# EAGLE design ULA (EAGLE 9.6.2)
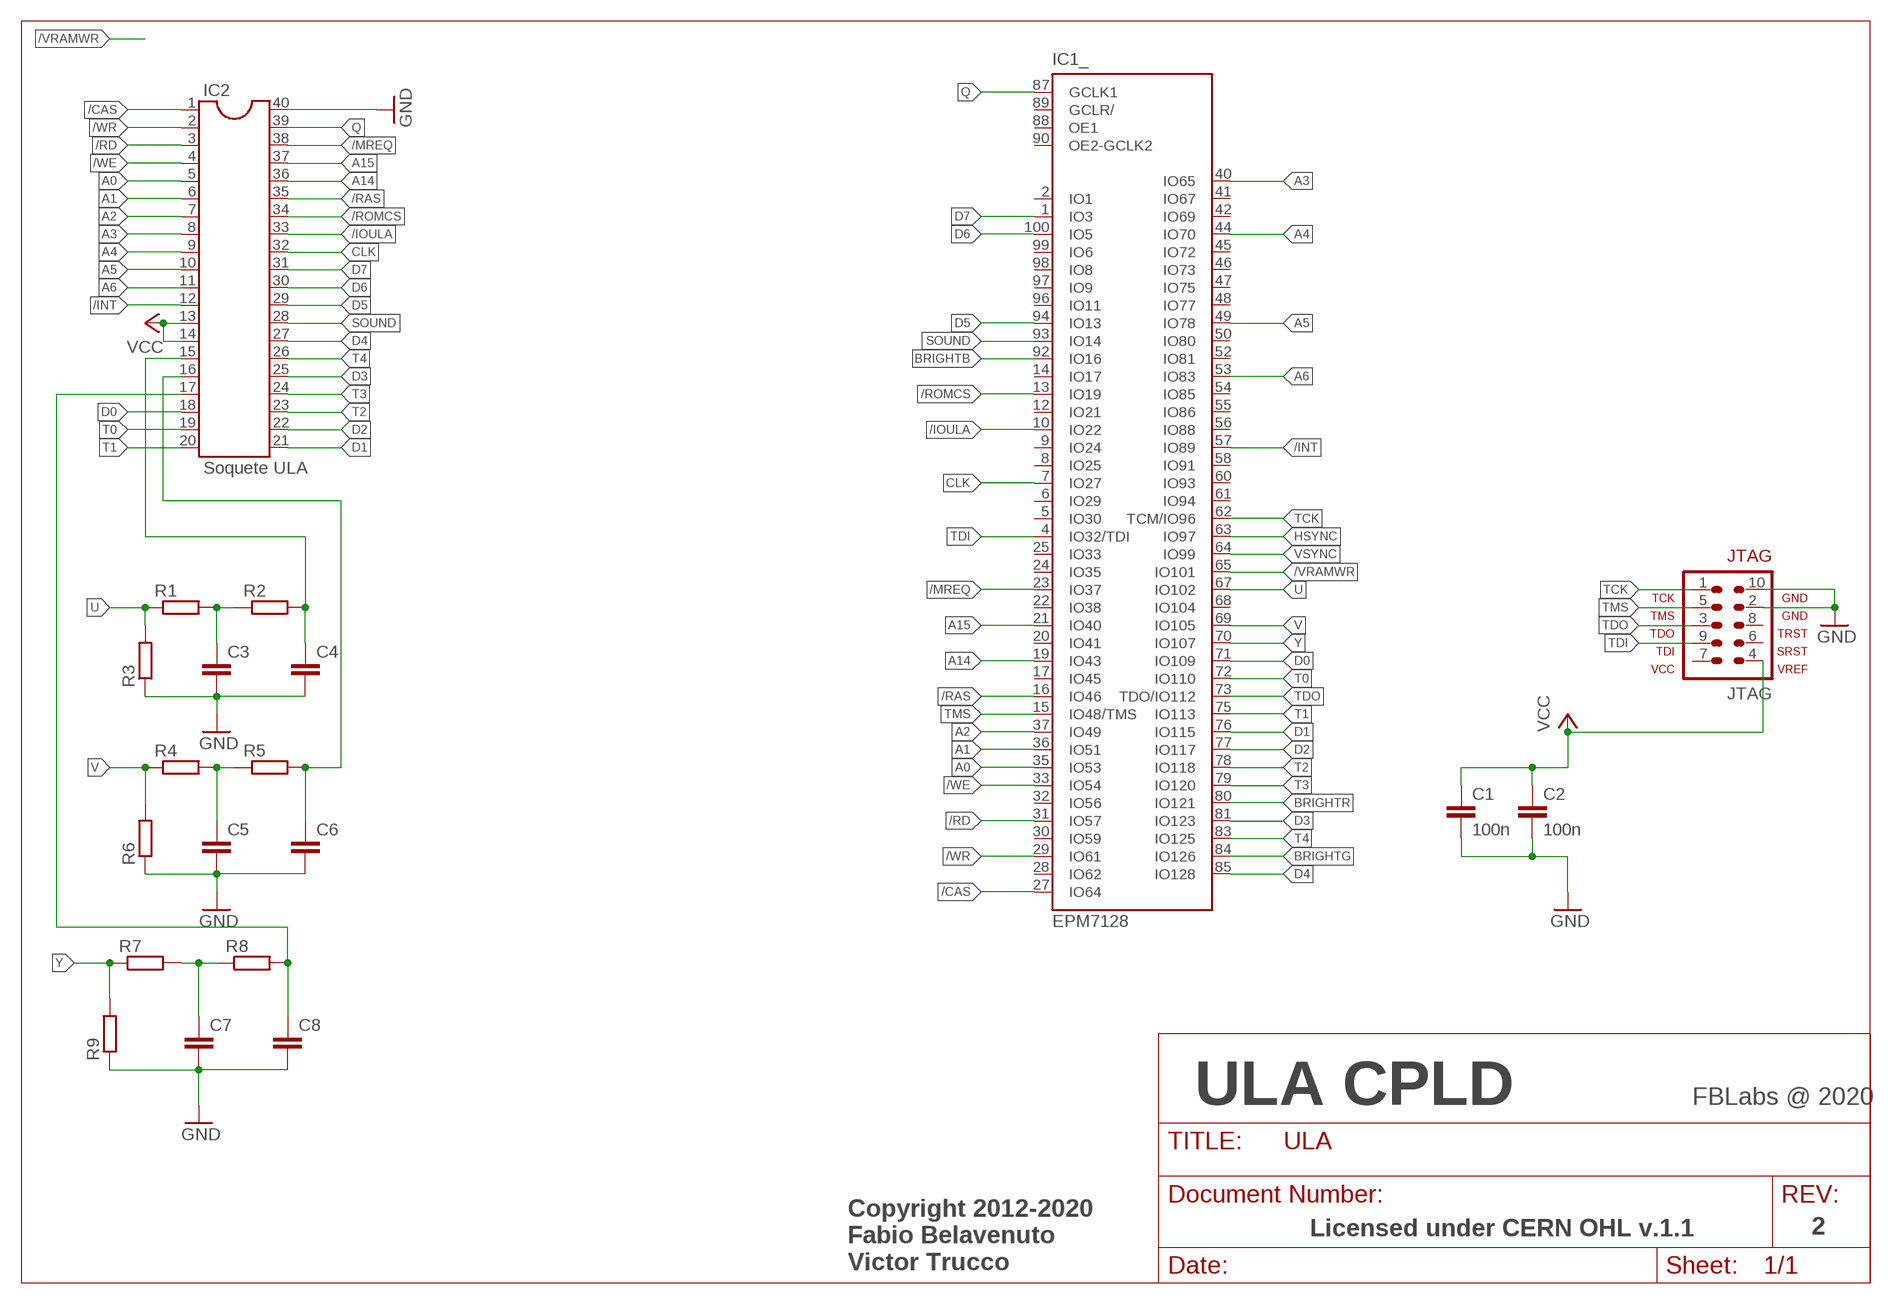
[diagram p0: schematic, sheet 1]

## Parts
C1  100n  C-EUC1206  [C1206]
C2  100n  C-EUC1206  [C1206]
C3  C-EUC0805K  [C0805K]
C4  C-EUC0805K  [C0805K]
C5  C-EUC0805K  [C0805K]
C6  C-EUC0805K  [C0805K]
C7  C-EUC0805K  [C0805K]
C8  C-EUC0805K  [C0805K]
IC1  EPM7128  EPM7128-T100  [TQFP100]
IC2  Soquete ULA  DIL40  [DIL40]
JTAG  AVR-JTAG-10  [AVR-JTAG-10]
R1  R-EU_M0805  [M0805]
R2  R-EU_M0805  [M0805]
R3  R-EU_M0805  [M0805]
R4  R-EU_M0805  [M0805]
R5  R-EU_M0805  [M0805]
R6  R-EU_M0805  [M0805]
R7  R-EU_M0805  [M0805]
R8  R-EU_M0805  [M0805]
R9  R-EU_M0805  [M0805]

## Nets
/CAS: IC1.27(_:IO64) IC2.1
/INT: IC1.57(_:IO89) IC2.12
/IOULA: IC1.10(_:IO22) IC2.33
/MREQ: IC1.23(_:IO37) IC2.38
/RAS: IC1.16(_:IO46) IC2.35
/RD: IC1.31(_:IO57) IC2.3
/ROMCS: IC1.13(_:IO19) IC2.34
/VRAMWR: IC1.65(_:IO101)
/WE: IC1.33(_:IO54) IC2.4
/WR: IC1.29(_:IO61) IC2.2
A0: IC1.35(_:IO53) IC2.5
A1: IC1.36(_:IO51) IC2.6
A2: IC1.37(_:IO49) IC2.7
A3: IC1.40(_:IO65) IC2.8
A4: IC1.44(_:IO70) IC2.9
A5: IC1.49(_:IO78) IC2.10
A6: IC1.53(_:IO83) IC2.11
A14: IC1.19(_:IO43) IC2.36
A15: IC1.21(_:IO40) IC2.37
BRIGHTB: IC1.92(_:IO16)
BRIGHTG: IC1.84(_:IO126)
BRIGHTR: IC1.80(_:IO121)
CLK: IC1.7(_:IO27) IC2.32
D0: IC1.71(_:IO109) IC2.18
D1: IC1.76(_:IO115) IC2.21
D2: IC1.77(_:IO117) IC2.22
D3: IC1.81(_:IO123) IC2.25
D4: IC1.85(_:IO128) IC2.27
D5: IC1.94(_:IO13) IC2.29
D6: IC1.100(_:IO5) IC2.30
D7: IC1.1(_:IO3) IC2.31
GND [Power]: C1.2 C2.2 C3.2 C4.2 C5.2 C6.2 C7.2 C8.2 IC2.40 JTAG.2 JTAG.10 R3.1 R6.1 R9.1
HSYNC: IC1.63(_:IO97)
N$1: C5.1 R4.2 R5.1
N$2: C3.1 R1.2 R2.1
N$3: C4.1 IC2.15 R2.2
N$4: C6.1 IC2.16 R5.2
N$5: C7.1 R7.2 R8.1
N$6: C8.1 IC2.17 R8.2
Q: IC1.87(_:GCLK1) IC2.39
SOUND: IC1.93(_:IO14) IC2.28
T0: IC1.72(_:IO110) IC2.19
T1: IC1.75(_:IO113) IC2.20
T2: IC1.78(_:IO118) IC2.23
T3: IC1.79(_:IO120) IC2.24
T4: IC1.83(_:IO125) IC2.26
TCK: IC1.62(_:TCM/IO96) JTAG.1
TDI: IC1.4(_:IO32/TDI) JTAG.9
TDO: IC1.73(_:TDO/IO112) JTAG.3
TMS: IC1.15(_:IO48/TMS) JTAG.5
U: IC1.67(_:IO102) R1.1 R3.2
V: IC1.69(_:IO105) R4.1 R6.2
VCC [Power]: C1.1 C2.1 IC2.13 IC2.14 JTAG.4
VSYNC: IC1.64(_:IO99)
Y: IC1.70(_:IO107) R7.1 R9.2
Unconnected: IC1.2(_:IO1) IC1.5(_:IO30) IC1.6(_:IO29) IC1.8(_:IO25) IC1.9(_:IO24) IC1.12(_:IO21) IC1.14(_:IO17) IC1.17(_:IO45) IC1.20(_:IO41) IC1.22(_:IO38) IC1.24(_:IO35) IC1.25(_:IO33) IC1.28(_:IO62) IC1.30(_:IO59) IC1.32(_:IO56) IC1.41(_:IO67) IC1.42(_:IO69) IC1.45(_:IO72) IC1.46(_:IO73) IC1.47(_:IO75) IC1.48(_:IO77) IC1.50(_:IO80) IC1.52(_:IO81) IC1.54(_:IO85) IC1.55(_:IO86) IC1.56(_:IO88) IC1.58(_:IO91) IC1.60(_:IO93) IC1.61(_:IO94) IC1.68(_:IO104) IC1.88(_:OE1) IC1.89(_:GCLR/) IC1.90(_:OE2-GCLK2) IC1.96(_:IO11) IC1.97(_:IO9) IC1.98(_:IO8) IC1.99(_:IO6) JTAG.6 JTAG.7 JTAG.8

## Notes on the sheet
- ULA CPLD | FBLabs @ 2020
- Licensed under CERN OHL v.1.1 | 2
- Copyright 2012-2020
  Fabio Belavenuto
  Victor Trucco

## Power pins joined to a net without a drawn wire
GND: IC1.11(9:GND) IC1.26(10:GND) IC1.38(16:GND) IC1.43(11:GND) IC1.59(12:GND) IC1.74(13:GND) IC1.86(14:GND) IC1.95(15:GND)
VCC: IC1.39(1:VCC) IC1.91(2:VCC)
VCCIO: IC1.3(3:VCCIO) IC1.18(4:VCCIO) IC1.34(5:VCCIO) IC1.51(6:VCCIO) IC1.66(7:VCCIO) IC1.82(8:VCCIO)

## Library data of the parts
C1 C2 = rcl:C-EU: CAPACITOR, European symbol
C3-C8 = rcl:C-EU: CAPACITOR, European symbol; SPICEPREFIX: C
IC1 = altera2:EPM7128-?100: EPM70128 MAX 7000 family; MPN: EPM7128STC100-7N; OC_FARNELL: 1549427; OC_NEWARK: 51R9778
IC2 = ULA_libs:DIL40: Dual In Line
JTAG = avr-4:AVR-JTAG-10: AVR JTAG Debug/Programming Header
R1-R9 = rcl:R-EU_: RESISTOR, European symbol; SPICEPREFIX: R

## Net classes
0 default: width 0.152 mm, drill 0.483 mm, clearance 0.152 mm
1 Power: width 0.203 mm, drill 0.584 mm, clearance 0.203 mm

## Board
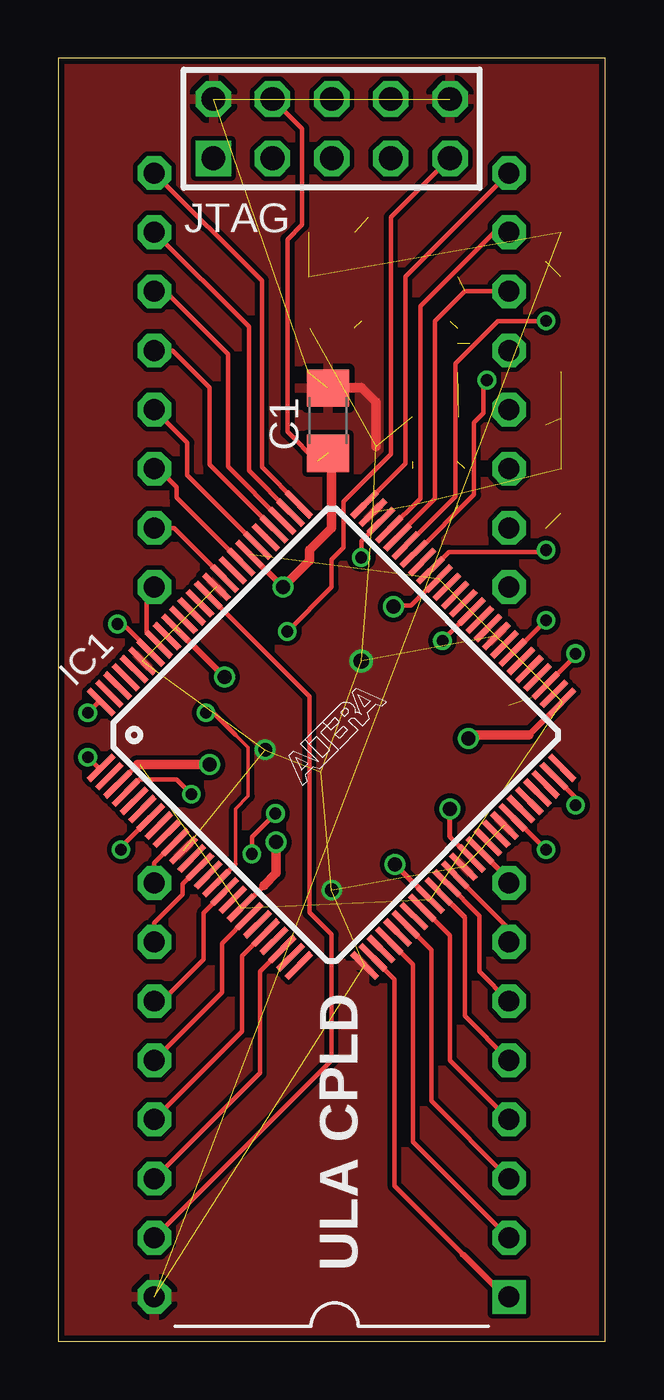
[diagram p1: board, top side]
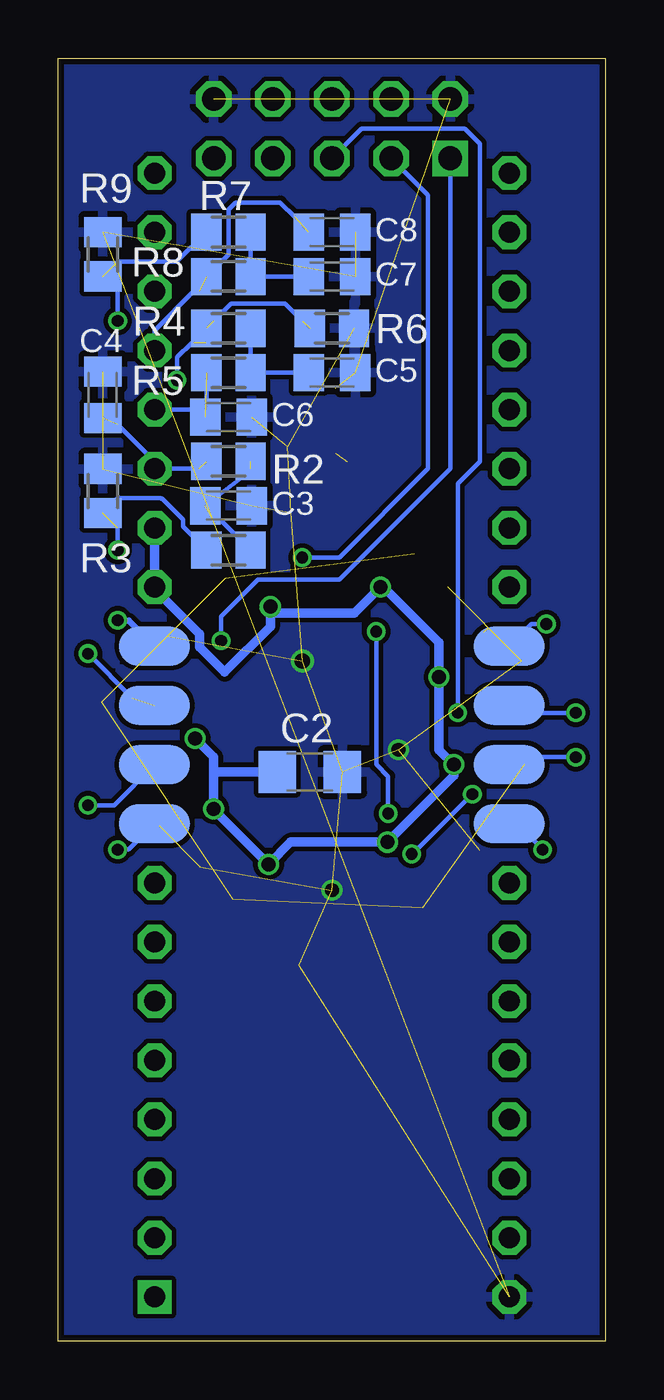
[diagram p2: board, bottom side, seen from below]

Size 23.51 x 55.09 mm. Coordinates in mm from the lower left corner, seen from the top.
Outline: 0,0 23.51,0 23.51,55.09 0,55.09 0,0
Copper layers (1*16): Top 0.035mm / dielectric 1.5mm / Bottom 0.035mm
Design rules "Seedstudio(6mil) *": minimum track width 6mil, minimum drill 12mil, track to track 6mil, track to pad 6mil, pad to pad 6mil, via to via 6mil, smd to smd 0mil, copper to edge 10mil, drill to drill 10mil, minimum pad ring 10mil, minimum via ring 6mil, stop-mask expansion 2mil, vias tented up to drill 100mil, thermal gap 10mil

### Footprints (pad centres in the part's own frame; a part is rotated, then mirrored left to right if it is on the bottom)
C1206 = smd 1.6 x 1.8: 1 -1.4,0; 2 1.4,0
C0805K = smd 1.3 x 1.6: 1 -1,0; 2 1,0
TQFP100 = smd 1.5 x 0.25: 1 -8,6; 2 -8,5.5; 3 -8,5; 4 -8,4.5; 5 -8,4; 6 -8,3.5; 7 -8,3; 8 -8,2.5; 9 -8,2; 10 -8,1.5; 11 -8,1; 12 -8,0.5; 13 -8,0; 14 -8,-0.5; 15 -8,-1; 16 -8,-1.5; 17 -8,-2; 18 -8,-2.5; 19 -8,-3; 20 -8,-3.5; 21 -8,-4; 22 -8,-4.5; 23 -8,-5; 24 -8,-5.5; 25 -8,-6; 51 8,-6; 52 8,-5.5; 53 8,-5; 54 8,-4.5; 55 8,-4; 56 8,-3.5; 57 8,-3; 58 8,-2.5; 59 8,-2; 60 8,-1.5; 61 8,-1; 62 8,-0.5; 63 8,0; 64 8,0.5; 65 8,1; 66 8,1.5; 67 8,2; 68 8,2.5; 69 8,3; 70 8,3.5; 71 8,4; 72 8,4.5; 73 8,5; 74 8,5.5; 75 8,6 | smd 0.25 x 1.5: 26 -6,-8; 27 -5.5,-8; 28 -5,-8; 29 -4.5,-8; 30 -4,-8; 31 -3.5,-8; 32 -3,-8; 33 -2.5,-8; 34 -2,-8; 35 -1.5,-8; 36 -1,-8; 37 -0.5,-8; 38 0,-8; 39 0.5,-8; 40 1,-8; 41 1.5,-8; 42 2,-8; 43 2.5,-8; 44 3,-8; 45 3.5,-8; 46 4,-8; 47 4.5,-8; 48 5,-8; 49 5.5,-8; 50 6,-8; 76 6,8; 77 5.5,8; 78 5,8; 79 4.5,8; 80 4,8; 81 3.5,8; 82 3,8; 83 2.5,8; 84 2,8; 85 1.5,8; 86 1,8; 87 0.5,8; 88 0,8; 89 -0.5,8; 90 -1,8; 91 -1.5,8; 92 -2,8; 93 -2.5,8; 94 -3,8; 95 -3.5,8; 96 -4,8; 97 -4.5,8; 98 -5,8; 99 -5.5,8; 100 -6,8
DIL40 = drill 0.9 pad 1.448 square: 1 -24.13,-7.62 | drill 0.9 pad 1.448 octagon: 2 -21.59,-7.62; 3 -19.05,-7.62; 4 -16.51,-7.62; 5 -13.97,-7.62; 6 -11.43,-7.62; 7 -8.89,-7.62; 8 -6.35,-7.62; 13 6.35,-7.62; 14 8.89,-7.62; 15 11.43,-7.62; 16 13.97,-7.62; 17 16.51,-7.62; 18 19.05,-7.62; 19 21.59,-7.62; 20 24.13,-7.62; 21 24.13,7.62; 22 21.59,7.62; 23 19.05,7.62; 24 16.51,7.62; 25 13.97,7.62; 26 11.43,7.62; 27 8.89,7.62; 28 6.35,7.62; 33 -6.35,7.62; 34 -8.89,7.62; 35 -11.43,7.62; 36 -13.97,7.62; 37 -16.51,7.62; 38 -19.05,7.62; 39 -21.59,7.62; 40 -24.13,7.62 | smd 1.676 x 3.048 bottom: 9 -3.81,-7.62; 10 -1.27,-7.62; 11 1.27,-7.62; 12 3.81,-7.62; 29 3.81,7.62; 30 1.27,7.62; 31 -1.27,7.62; 32 -3.81,7.62
AVR-JTAG-10 = drill 1.016 square: 1 -5.08,-1.27 | drill 1.016 octagon: 2 -5.08,1.27; 3 -2.54,-1.27; 4 -2.54,1.27; 5 0,-1.27; 6 0,1.27; 7 2.54,-1.27; 8 2.54,1.27; 9 5.08,-1.27; 10 5.08,1.27
M0805 = smd 1.3 x 1.6: 1 -0.95,0; 2 0.95,0

### Placement (x,y rotation side)
C1  11.59,39.53 90 top
C2  12.7,24.45 0 bottom
C3  16.19,35.88 0 bottom
C4  21.59,40.64 90 bottom
C5  11.75,41.59 0 bottom
C6  16.19,39.69 0 bottom
C7  11.75,45.72 0 bottom
C8  11.75,47.62 0 bottom
IC1  11.75,26.04 45 top
IC2  11.75,26.04 90 top
JTAG  11.75,52.07 0 top
R1  16.19,33.97 0 bottom
R2  16.19,37.78 180 bottom
R3  21.59,36.51 270 bottom
R4  16.19,43.5 0 bottom
R5  16.19,41.59 180 bottom
R6  11.75,43.5 180 bottom
R7  16.19,47.62 0 bottom
R8  16.19,45.72 180 bottom
R9  21.59,46.67 270 bottom

### Tracks (layer width: path | path; a pad name or v marks a point on that pad's centre or on a via)
/CAS
  Top 0.203: 17.38,3.73 14.45,6.67 14.45,15.55 IC1.27
  Top 0.254: IC2.1 19.21,1.91 17.38,3.73
/INT  (via drill 0.5)
  Top 0.203: IC1.57 19.57,29.57 v20.95,30.96
  Bottom 0.254: v20.95,30.96 20.48,30.96 IC2.12
/IOULA
  Top 0.203: IC2.33 4.13,20.54 IC1.10
/MREQ
  Top 0.203: IC2.38 8.66,11.52 8.66,15.88 IC1.23
/RAS
  Top 0.203: IC2.35 4.44,14.61 6.25,16.41 6.25,18.39 7.15,19.3
  Top 0.208: 7.15,19.3 IC1.16
/RD
  Top 0.203: IC2.3 16.03,10.32 16.03,16.79 IC1.31
/ROMCS
  Top 0.203: IC2.34 4.13,17.97 5.35,19.2 5.35,19.63 IC1.13
/VRAMWR
  Top 0.203: IC1.65 16.7,32.41
/WE
  Top 0.203: IC2.4 16.83,12.07 16.83,17.42 IC1.33
/WR
  Top 0.203: IC2.2 15.24,8.57 15.24,16.18 IC1.29
A0
  Top 0.203: IC2.5 17.46,13.97 17.46,18.2
  Top 0.208: 17.46,18.2 IC1.35
A1
  Top 0.203: IC2.6 18.1,15.88 18.1,18.27 IC1.36
A2
  Top 0.203: 19.37,17.71 IC1.37
  Top 0.254: IC2.7 19.37,17.71
A3
  Top 0.208: IC2.8 19.37,19.83 IC1.40
A4  (via drill 0.5)
  Top 0.203: IC1.44 19.57,22.5 v20.95,21.11
  Bottom 0.203: v20.95,21.11 20.48,21.11 IC2.9
A5  (via drill 0.5)
  Top 0.203: IC1.49 22.22,23.34 v22.22,23.02
  Bottom 0.203: v22.22,23.02 21.11,23.02 IC2.10
A6  (via drill 0.5)  (1 unrouted)
  Top 0.203: IC1.53 22.22,29.44 v22.22,29.53
  Bottom 0.203: v22.22,29.53 20.32,27.62
A14
  Top 0.203: IC2.36 7.05,14.99 7.05,17.09 IC1.19
  Top 0.208: IC1.19
A15
  Top 0.203: 8.9,17.55 7.91,16.55 7.91,13.3 IC2.37
  Top 0.208: 8.9,17.55 IC1.21
BRIGHTB
  Top 0.203: IC1.92 4.65,30.28
BRIGHTG
  Top 0.203: IC1.84 7.5,33.13
BRIGHTR
  Top 0.203: IC1.80 8.92,34.58
CLK  (via drill 0.5)
  Top 0.203: v2.7,21.11 2.7,21.23 IC1.7
  Bottom 0.203: 3.81,22.22 v2.7,21.11
  Bottom 0.254: IC2.32 3.81,22.22
D0
  Top 0.203: IC2.18 17.46,45.09 16.19,43.81 16.19,36.2 14.58,34.58 IC1.71
D1
  Top 0.203: IC2.21 8.75,45.55 8.75,37.55 10.33,35.96 IC1.76
D2
  Top 0.203: IC1.77 8.19,37.38 8.19,43.56 IC2.22
  Top 0.208: IC1.77
D3
  Top 0.203: IC2.25 5.55,38.59 5.55,37.19 IC1.81
D4
  Top 0.203: IC1.85 4.98,34.92 IC2.27
D5  (via drill 0.5)
  Top 0.203: IC1.94 3.97,29.61 2.94,30.64 2.7,30.64 v2.54,30.8
  Bottom 0.203: v2.54,30.8 3.18,30.8 IC2.29
  Bottom 0.208: 3.97,30 IC2.29
D6  (via drill 0.5)
  Top 0.203: 1.73,27.45 v1.27,26.99
  Top 0.254: IC1.100 1.73,27.45
  Bottom 0.203: v1.27,26.99 3.81,26.99 IC2.30
D7  (via drill 0.5)
  Top 0.203: IC1.1 1.73,24.62 v1.27,25.08
  Bottom 0.203: v1.27,25.08 3.81,25.08 IC2.31
GND  (via drill 0.58 pad 0.25, 0.66)  (24 unrouted)
  Top 0.406: 13.65,38.42 13.65,40.32 13.02,40.96 11.62,40.96 C1.2
  other vias: 8.89,25.4 13.02,29.21 11.75,19.37
  pour Top: -1.95,56.09 -1.95,-2.91 27.05,-2.91 27.05,56.09
  pour Bottom: -2.43,56.57 27.52,56.73 27.52,-3.38 -2.43,-3.54
N$1
  Bottom 0.203: C5.1 R5.1 R4.2
N$2  (2 unrouted)
  Bottom 0.203: R1.2 16.51,35.24 16.83,35.24 | C3.1 15.19,37.42 15.24,37.46
N$3  (2 unrouted)
  Bottom 0.203: 20.95,39.37 19.37,37.78 IC2.15 17.46,37.46
N$4  (1 unrouted)
  Bottom 0.203: IC2.16 17.46,40 17.14,40.32 R5.2
N$5
  Bottom 0.203: C7.1 R8.1 R7.2
N$6  (2 unrouted)
  Bottom 0.203: IC2.17 19.37,43.4 17.68,45.09 17.46,45.09 | R8.2 16.19,46.67 16.19,48.59 15.89,48.89 13.97,48.89 13.33,48.26
Q
  Top 0.203: IC2.39 11.75,12.07 11.75,17.46 10.8,18.41 10.8,27.7 IC1.87
SOUND
  Top 0.203: IC1.93 3.8,30.44 3.8,32.17 4.02,32.38 IC2.28
T0
  Top 0.203: 14.24,34.87 15.56,36.2 15.56,44.45 18.73,47.62 IC2.19
  Top 0.208: IC1.72 14.24,34.87
T1
  Top 0.203: IC1.75 14.92,37.7 14.92,45.72 IC2.20
T2
  Top 0.203: IC1.78 7.3,37.55 7.3,42.39 4.6,45.09 IC2.23
T3
  Top 0.203: IC1.79 6.51,37.64 6.51,40.96 4.92,42.55 IC2.24
T4
  Top 0.203: IC1.83 5.08,36.24 5.08,36.67 4.29,37.46 IC2.26
TCK  (via drill 0.5)
  Top 0.203: IC1.62 v16.51,30.08
  Bottom 0.203: v16.51,30.08 16.51,31.12 14.92,32.7 11.43,32.7 6.67,37.46 JTAG.1
TDI  (via drill 0.5)
  Top 0.203: IC1.4 3.48,24.13 5.08,24.13 v5.72,23.49 | v8.32,20.92 8.32,21.65 v9.33,22.67 | v9.84,30.48 11.75,32.38 11.75,33.57 12.26,34.08 12.26,36.07 14.29,38.1 14.29,48.26 JTAG.9
  Top 0.254: IC1.4 2.91,23.55
  Bottom 0.203: v8.32,20.92 8.29,20.92 v5.72,23.49 | v9.33,22.67 9.33,24.25 9.84,24.77 v9.84,30.48
TDO  (via drill 0.5)
  Top 0.203: IC1.73 13.02,34.37 v13.02,33.66
  Top 0.254: IC1.73
  Bottom 0.203: JTAG.3 7.62,49.21 7.62,37.46 11.43,33.66 v13.02,33.66
TMS  (via drill 0.48)
  Top 0.152: 7.62,20.49 7.62,22.86 8.17,23.41 8.17,25.49 7.62,26.04
  Top 0.203: IC1.15 7.62,20.49 | v6.34,26.99 6.67,26.99 7.62,26.04
  Top 0.254: IC1.15 6.8,19.66
  Bottom 0.203: v6.34,26.99 6.34,36.84 5.4,37.78 5.4,51.44 6.03,52.07 10.48,52.07 JTAG.5
U  (via drill 0.5)  (1 unrouted)
  Top 0.203: IC1.67 16.78,33.9 20.88,33.9 v20.95,33.97
  Bottom 0.203: R3.2 20.95,36.2 19.1,36.2 19.05,36.2 18.15,35.29 18.15,34.98 R1.1 | v20.95,33.97 20.95,34.92
V  (via drill 0.5)  (3 unrouted)
  Top 0.203: IC1.69 15.32,33.81 17.86,36.35 17.86,39.45 18.26,39.85 18.26,41.12 v18.41,41.27
  Bottom 0.203: R4.1 17.05,43.5 17.69,42.86 | v18.41,41.27 18.39,41.3 18.39,42.25 17.78,42.86 17.15,42.86 | 16.83,43.81 16.09,44.55 13.75,44.55 13.02,43.81
VCC  (via drill 0.6)  (2 unrouted)
  Top 0.203: v14.4,31.54 14.45,31.59 15.16,31.59 16.32,32.75 | IC1.39 16.83,21.66 | 11.11,37.78 9.84,39.05 9.84,47.31 10.48,47.94 10.48,52.07 JTAG.4
  Top 0.208: 7.91,18.65 8.83,19.58 | 16.83,21.66 v16.83,22.86 | v14.47,20.48 15.96,18.99
  Top 0.254: v7.14,28.52 5.24,30.43 | 21.58,27.37 20.21,26.04 | 8.23,33.81 v9.66,32.38
  Top 0.406: 3.41,24.77 v6.51,24.77 | v9.37,21.43 9.37,20.11 8.83,19.58 | 20.21,26.04 17.78,26.04 v17.62,25.88 | v9.66,32.38 10.8,33.52 10.8,33.97 11.75,34.92 11.75,37.97 C1.1
  Bottom 0.406: 16.83,24.45 v16.83,22.86 16.83,22.83 v14.47,20.48 13.52,21.43 v9.37,21.43 6.51,24.29 v6.51,24.77 7.14,25.4 v7.14,28.52 7.14,30 9.52,32.38 v9.66,32.38 10.77,31.27 14.13,31.27 v14.4,31.54 14.4,30.69 16.35,28.73 17.44,29.82 17.44,30.36 19.37,32.29 IC2.13 IC2.14 | C2.1 16.83,24.45 | 16.83,24.45 16.83,25.08 v17.62,25.88
VCCIO  (5 unrouted)
  Top 0.203: IC1.3 3.41,24.77 3.49,24.77
VSYNC
  Top 0.203: IC1.64
Y  (via drill 0.5)  (1 unrouted)
  Top 0.203: IC1.70 14.96,34.17 17.07,36.27 17.07,41.99 18.89,43.81 v20.95,43.81
  Bottom 0.203: v20.95,43.81 20.95,45.09 R9.2 | R7.1 18.41,46.35 20.95,46.35

### Text on the board
tPlace: ULA CPLD